# Altium schematic sheet Voeding.SchDoc
size A4; SheetNumber: 3; SheetTotal: 5
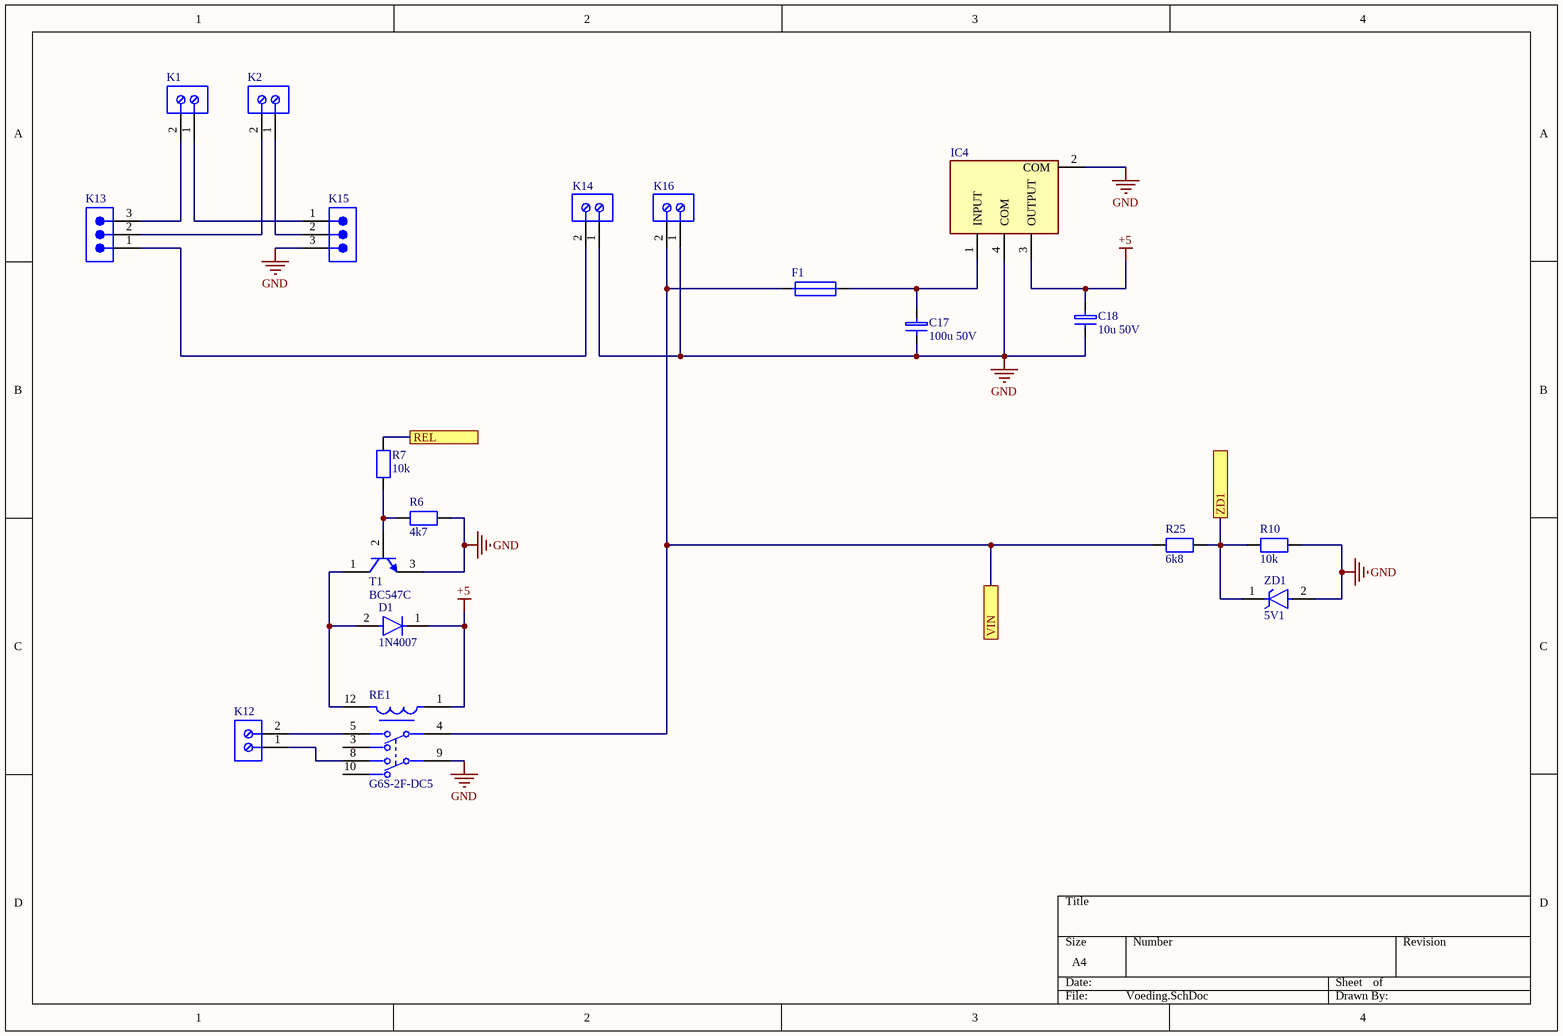
[diagram p0: Voeding.SchDoc]

## Parts
C17  100u 50V  [CAPACITOR100UF]
C18  10u 50V  [CAPACITOR100UF]
D1  1N4007  [1N4007]
F1  696101000002  [FuseHolder]  (value not drawn)
IC4  TL780-05CKTTR  [DC-DC Convertor]  (value not drawn)
K1  (no value)  [Shroefconnecter]
K2  (no value)  [Shroefconnecter]
K12  282836-2  [Shroefconnecter]  (value not drawn)
K13  (no value)  [[3][1]Pinheader]
K14  282836-2  [Shroefconnecter]  (value not drawn)
K15  61300311121  [[3][1]Pinheader]  (value not drawn)
K16  282836-2  [Shroefconnecter]  (value not drawn)
R6  4k7  [Resistor]
R7  10k  [Resistor]
R10  10k  [Resistor]
R25  6k8  [Resistor]
RE1  G6S-2F-DC5  [VermogenRelais]
T1  BC547C  [BC547C]
ZD1  5V1  [Zenerdiode]

## Ports
REL (see CPU[2B]), VIN (see Regelaar[2A]), ZD1 (see CPU[3B])

## Nets
+5: C18.1 D1.1(C) IC4.3(OUTPUT) RE1.1
GND: C17.2 C18.2 IC4.2(COM) IC4.4(COM) K14.1 K15.3 K16.1 R6.2 R10.2 RE1.9 T1.3(E) ZD1.2(A)
REL: R7.1 ; port REL
VIN: F1.1 K16.2 R25.1 RE1.4 ; port VIN
ZD1: R10.1 R25.2 ZD1.1(K) ; port ZD1
NetC17_1: C17.1 F1.2 IC4.1(INPUT)
NetD1_2: D1.2(A) RE1.12 T1.1(C)
NetK1_1: K1.1 K15.1
NetK1_2: K1.2 K13.3
NetK2_1: K2.1 K15.2
NetK2_2: K2.2 K13.2
NetK12_1: K12.1 RE1.8
NetK12_2: K12.2 RE1.5
NetK13_1: K13.1 K14.2
NetR6_1: R6.1 R7.2 T1.2(B)

Not connected (* = marked no-connect by the designer): RE1 3 10

## Library data of the parts
C17 C18 = CapacitorPol: 860010683032 WCAP-ATG8 Aluminum Electrolytic Capacitors; NexarPartId: 53914131; Pitch: 10mm; Capacitance: 4.7mF; Tolerance: 20%; Polarity: Polar; Ripple Current: 3.355A; Life (Hours): 2000hours; Leakage Current: 2.35mA; Mount: Through Hole; REACH SVHC: Unknown; Voltage Rating (DC): 50V; Voltage Rating: 50V; Case/Package: Radial; Height - Seated (Max): 43.0022mm; Length: 41mm; Lead Pitch: 10.0076mm; Height: 41mm; Diameter: 22mm; RoHS: Compliant; Max Operating Temperature: 85°C; Min Operating Temperature: -40°C
D1 = Diode: DIODE GEN PURP 1KV 1A DO41; Max Surge Current: 30A; Recovery Time: 2000ns; Element Configuration: Single; Polarity: Standard; Reverse Recovery Time: 2us; Capacitance: 15pF; Forward Voltage: 1V; Max Reverse Current: 5uA; Radiation Hardening: No; Number of Pins: 2; Current Rating: 1A; Reverse Voltage: 1kV; Output Current: 1A; Mount: Through Hole; Average Rectified Current: 1A; Lead Free: Lead Free; Peak Non-Repetitive Surge Current: 30A; Max Reverse Voltage (DC): 1kV; Voltage Rating (DC): 1kV; Max Repetitive Reverse Voltage (Vrrm): 1kV; Diameter: 2.7mm; Forward Current: 1A; RoHS Compliant: Yes; Package Quantity: 1; Length: 5.2mm; Max Forward Surge Current (Ifsm): 30A; Packaging: Tape and Reel; Case/Package: DO-41; Min Operating Temperature: -55°C; Max Operating Temperature: 150°C
F1 = FuseHolder: NexarPartId: 56808803; Fuse Current: 10A; Voltage Rating (AC): 250V; RoHS: Non-Compliant; Max Operating Temperature: 120°C; Min Operating Temperature: -30°C; Mount: Through Hole; Packaging: Box; Height: 13.6mm; REACH SVHC: Unknown
IC4 = DC/DC Convertor: IC REG LIN 5V 1.5A DDPAK/TO263-3; Max Input Voltage: 25V; Number of Outputs: 1; Dropout Voltage: 2V; Polarity: Positive; Output Type: Fixed; Quiescent Current: 8mA; Min Input Voltage: 7V; Power Supply Rejection Ratio (PSRR): 85dB; Accuracy: 1%; Lead Free: Lead Free; Min Operating Temperature: 0°C; Number of Pins: 3; Max Output Voltage: 5V; Case/Package: TO-263; Number of Regulators: 1; Packaging: Tape and Reel; Max Operating Temperature: 125°C; Max Output Current: 1.5A; Nominal Output Voltage: 5V; Height: 4.83mm; Mount: Surface Mount; Weight: 0.050897oz; Output Current: 1.5A; Width: 9.65mm; Output Voltage: 5V; Length: 10.67mm; REACH SVHC: No SVHC; Output Voltage Accuracy: 1%; Package Quantity: 1
K1 K2 K12 K14 K16 = Schroefconnector: Female Header, Pitch 5 mm, 1 x 2 Position, Height 10 mm, Tail Length 3.5 mm, Rohs, Bulk; Manufacturer: TE Connectivity; Wire Gauge: 16-30AWG; Product Training Modules: Wire-to-BoardEurostyleTerminalBlocks; Clamp Material - Plating: Brass-NickelPlated; Voltage: 300V; Mating Orientation: HorizontalwithBoard; Current: 13.5A; Pitch: 0.197"(5.00mm); Screw Thread: M3; 3D Model: 282836-2.pdf; Other Names: 5ULV-02B / A98076; Dynamic Catalog: BuchananSeries; Number of Levels: 1; Torque - Screw: 0.68Nm(6Lb-In); Featured Product: EurostyleTerminalBlockConnectors; Positions Per Level: 2; Wire Termination: Screw-RisingCageClamp; Datasheet URL: http://www.te.com.cn/commerce/DocumentDelivery/DDEController?Action=showdoc&DocId=Catalog+Section%7F1308389_EUROSTYLE_TERMINAL_BLOCKS%7F0607%7Fpdf%7FEnglish%7FENG_CS_1308389_EUROSTYLE_TERMINAL_BLOCKS_0607.pdf%7F282836-2; Color: Green; Family: TerminalBlocks-WiretoBoard; RoHS Information: 282836-2StatementofCompliance; Standard Package: 300; Contact Material - Plating: Brass-TinPlated; Manufacturer URL: http://www.te.com; Housing Material: Polyamide(PA66),Nylon6/6; Features: Interlocking(Side); Package Description: Female Header, Pitch 5 mm, 1 x 2 Position, Height 10 mm, Tail Length 3.5 mm; Mounting Type: ThroughHole; Package Reference: THD; Packaging: Bulk; Series: Buchanan; Category: Connectors,Interconnects; Screw Material - Plating: Brass-NickelPlated
K13 K15 = [3][1]Pinheader: NexarPartId: 32855521; Voltage Rating: 250V; Current Rating: 3A; Connector Type: Male Pin; Number of Positions: 3; Gender: Male; Contact Resistance: 20mΩ; Pitch: 2.54mm; Max Operating Temperature: 105°C; Lead Pitch: 2.54mm; Lead Free: Lead Free; Contact Mating Length: 5.9944mm; Contact Material: Copper; Number of Pins: 3; Orientation: Vertical; Height: 8.94mm; Packaging: Bulk; Min Operating Temperature: -40°C; Mount: Through Hole; RoHS: Compliant; Number of Contacts: 3; Operating Supply Voltage: 250V; Termination: Solder; Number of Rows: 1; Contact Plating: Gold; Color: Black; REACH SVHC: Unknown
R6 R7 R10 R25 = Resistor: Manufacturer: Vishay Dale; Part Number: CRCW08050000Z0EA
RE1 = VermogenRelais: RELAY TELECOM DPDT 2A 5VDC; Manufacturer: Omron; Coil Resistance: 178Ω; Coil Current: 28.1mA; Coil Voltage: 5V; Standoff Height: 0.35mm; Coil Power: 140mW; Coil Type: Non-Latching; Number Of Contacts: 2; RoHS: TRUE; Device Class L3: Signal Relays; Ambient Temperature Range Low: -40°C; Switching Current: 2A; Device Class L1: Electromechanical; Lead Free: Yes; Category: Relay; Digikey Description: RELAY TELECOM DPDT 2A 5VDC; Height: 9.4mm; Temperature: -40°C to +85°C; Throw Configuration: DPDT; Octopart: https://octopart.com/g6s-2f-dc5-omron-85236; Package: G6S-2F-DC5; Temperature Range High: +85°C; Automotive: No; Current Rating: 2A; Manufacturer Part Number: G6S-2F-DC5; Mouser Description: Electromechanical Relay 5VDC 178Ohm 2A DPDT (14.8x9.2x9.2)mm SMD Signal Relay; Temperature Range Low: -40°C; Device Class L2: Relays; Ambient Temperature Range High: +85°C; ComponentLink2URL: https://omronfs.omron.com/en_US/ecb/products/pdf/en-g6s.pdf; ComponentLink2Description: Datasheet
T1 = BC547C: Amplifier Transistor, NPN Silicon, 3-Pin TO-92, Bulk Box; Manufacturer: On Semiconductor; IC Continuous (A): 0.1; fT Min (MHz): 150; Mounting Technology: Through Hole; ComponentLink1URL: http://www.onsemi.com/; ComponentLink1Description: Manufacturer URL; ComponentLink3URL: http://www.onsemi.cn/pub_link/Collateral/2N6426-D.PDF; DatasheetVersion: Rev. 7; PackageVersion: Rev. AM; Packing: Bulk Box; RoHS: FALSE; Polarity: NPN; PartNumber: BC547C; ComponentLink2URL: http://www.onsemi.com/pub_link/Collateral/BC546-D.PDF; ComponentLink3Description: Package Specification; PackageDescription: 3-Pin Transistor Outline, Body 4.825 x 3.685 mm, Pitch 1.27 mm; PackageReference: TO-92-3-29-11_AM_SL; ComponentLink2Description: Datasheet
ZD1 = Zenerdiode: Zener Voltage Regulator, 500 mW, 2-Pin SOD-123, Pb-Free, Tape and Reel; PartNumber: MMSZ4689T1G; Manufacturer: On Semiconductor; VZ Typ (V): 5.1; P Max (W): 0.5; ComponentLink2URL: http://www.onsemi.com/pub_link/Collateral/MMSZ4678T1-D.PDF; PackageVersion: Rev. G, 10/2009; ComponentLink1Description: Manufacturer URL; PackageDescription: 2-Pin SOD, Body 1.6 x 2.69 mm; DatasheetVersion: Rev. 9; PackageReference: SOD-123-2-425-04; RoHS: Pb-Free; Mounting Technology: Surface Mount; ComponentLink3URL: http://www.onsemi.com/pub_link/Collateral/425-04.PDF; ComponentLink2Description: Datasheet; ComponentLink1URL: http://www.onsemi.com/; ComponentLink3Description: Package Specification; Packing: Tape and Reel